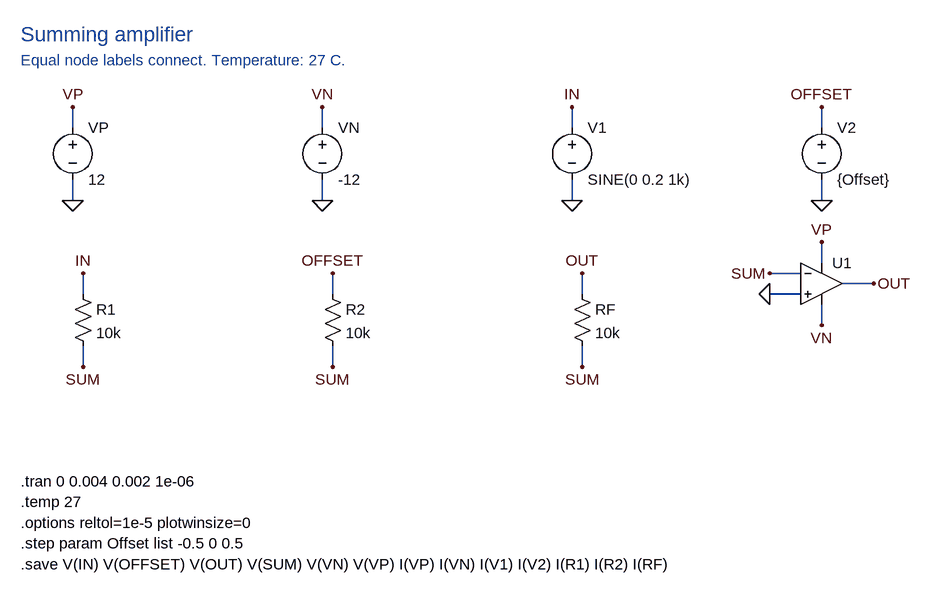
[diagram p0: schematic opamp-summing.asc]
opamp-summing.asc, the LTspice schematic file:
Version 4
SHEET 1 1740 1000
WIRE 144 176 144 144
WIRE 144 256 144 288
WIRE 528 176 528 144
WIRE 528 256 528 288
WIRE 912 176 912 144
WIRE 912 256 912 288
WIRE 1296 176 1296 144
WIRE 1296 256 1296 288
WIRE 160 432 160 400
WIRE 160 512 160 544
WIRE 544 432 544 400
WIRE 544 512 544 544
WIRE 928 432 928 400
WIRE 928 512 928 544
WIRE 1264 432 1216 432
WIRE 1264 400 1216 400
WIRE 1296 384 1296 352
WIRE 1296 448 1296 480
WIRE 1328 416 1376 416
FLAG 144 144 VP
FLAG 144 288 0
FLAG 528 144 VN
FLAG 528 288 0
FLAG 912 144 IN
FLAG 912 288 0
FLAG 1296 144 OFFSET
FLAG 1296 288 0
FLAG 160 400 IN
FLAG 160 544 SUM
FLAG 544 400 OFFSET
FLAG 544 544 SUM
FLAG 928 400 OUT
FLAG 928 544 SUM
FLAG 1216 432 0
FLAG 1216 400 SUM
FLAG 1296 352 VP
FLAG 1296 480 VN
FLAG 1376 416 OUT
SYMBOL voltage 144 160 R0
SYMATTR InstName VP
SYMATTR Value 12
SYMBOL voltage 528 160 R0
SYMATTR InstName VN
SYMATTR Value -12
SYMBOL voltage 912 160 R0
SYMATTR InstName V1
SYMATTR Value SINE(0 0.2 1k)
SYMBOL voltage 1296 160 R0
SYMATTR InstName V2
SYMATTR Value {Offset}
SYMBOL res 144 416 R0
SYMATTR InstName R1
SYMATTR Value 10k
SYMBOL res 528 416 R0
SYMATTR InstName R2
SYMATTR Value 10k
SYMBOL res 912 416 R0
SYMATTR InstName RF
SYMATTR Value 10k
SYMBOL OpAmps/UniversalOpamp2 1296 416 R0
SYMATTR InstName U1
SYMATTR SpiceModel level2
SYMATTR Value2 Avol=1Meg GBW=10Meg Slew=10Meg
SYMATTR SpiceLine Ilimit=100m Rail=0.5 Vos=0
SYMATTR SpiceLine2 En=0 Enk=0 In=0 Ink=0 Rin=1G
TEXT 64 32 Left 3 ;Summing amplifier
TEXT 64 72 Left 2 ;Equal node labels connect. Temperature: 27 C.
TEXT 64 720 Left 2 !.tran 0 0.004 0.002 1e-06
TEXT 64 752 Left 2 !.temp 27
TEXT 64 784 Left 2 !.options reltol=1e-5 plotwinsize=0
TEXT 64 816 Left 2 !.step param Offset list -0.5 0 0.5
TEXT 64 848 Left 2 !.save V(IN) V(OFFSET) V(OUT) V(SUM) V(VN) V(VP) I(VP) I(VN) I(V1) I(V2) I(R1) I(R2) I(RF)

The netlist it stands for:
* opamp-summing.asc
VP VP 0 12
VN VN 0 -12
V1 IN 0 SINE(0 0.2 1k)
V2 OFFSET 0 {Offset}
R1 IN SUM 10k
R2 OFFSET SUM 10k
RF OUT SUM 10k
XU1 0 SUM VP VN OUT level2 Avol=1Meg GBW=10Meg Slew=10Meg Ilimit=100m Rail=0.5 Vos=0 En=0 Enk=0 In=0 Ink=0 Rin=1G  ; pins In+ In- V+ V- OUT
* Summing amplifier
* Equal node labels connect. Temperature: 27 C.
.tran 0 0.004 0.002 1e-06
.temp 27
.options reltol=1e-5 plotwinsize=0
.step param Offset list -0.5 0 0.5
.save V(IN) V(OFFSET) V(OUT) V(SUM) V(VN) V(VP) I(VP) I(VN) I(V1) I(V2) I(R1) I(R2) I(RF)
.lib UniversalOpAmp2.lib
.backanno
.end